# Altium schematic sheet Battery Monitoring.SchDoc
size A4; Author1: Russell MacGregor; VersionControl_Repository: BatteryMonitorSpring2025; Organization: Machine Intellgence Laboratory; Des1: This IC monitors the voltage; Des2: of the battery and the current; Des3: drawn from it.; SheetNumber: 2; SheetTotal: 4
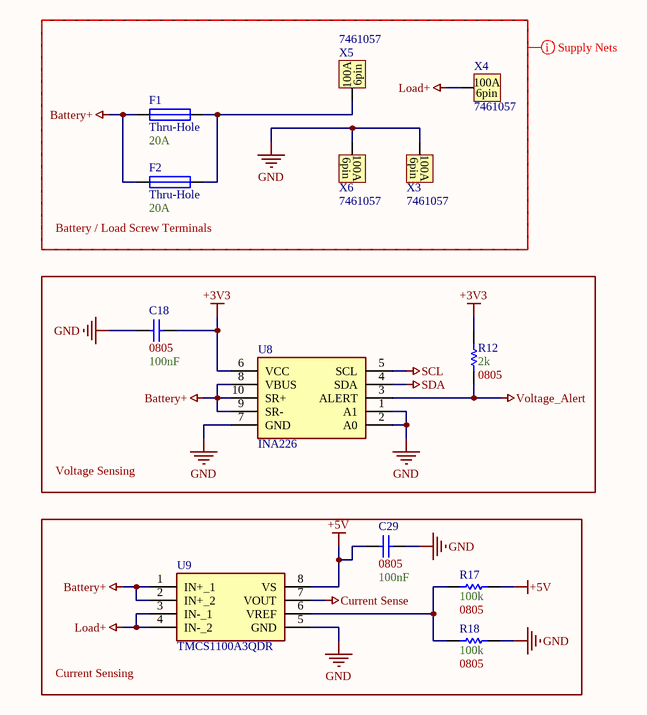
[diagram p0: Battery Monitoring.SchDoc]

## Parts
C18  Size Package: 0805  Capacitance: 100nF  [[Cap] SMD 0805]  (hidden comment: [Cap] SMD Nonpolarized)
C29  Size Package: 0805  Capacitance: 100nF  [[Cap] SMD 0805]  (hidden comment: [Cap] SMD Nonpolarized)
F1  Thru-Hole  Capacity: 20A  [[Fuse] Blade (2)]
F2  Thru-Hole  Capacity: 20A  [[Fuse] Blade (2)]
R12  Resistance: 2k  Size Package: 0805  [[Res] SMD 0805]  (hidden comment: [Res] SMD Resistor)
R17  Resistance: 100k  Size Package: 0805  [[Res] SMD 0805]  (hidden comment: [Res] SMD Resistor)
R18  Resistance: 100k  Size Package: 0805  [[Res] SMD 0805]  (hidden comment: [Res] SMD Resistor)
U8  INA226  [[IC] Battery Voltage Monitor (36V)]
U9  TMCS1100A3QDR  [[IC] Hall Effect Current Sensor]
X3  7461057  [[Port] Shank Connector (100A)]
X4  7461057  [[Port] Shank Connector (100A)]
X5  7461057  [[Port] Shank Connector (100A)]
X6  7461057  [[Port] Shank Connector (100A)]

## Blocks framed on the sheet
Battery / Load Screw Terminals: F1 F2 X3-X6
Voltage Sensing: C18 R12 U8
Current Sensing: C29 R17 R18 U9

## Nets
+3V3: C18.1 R12.2 U8.6(VCC)
+5V: C29.2 R17.2 U9.8(VS)
Battery+: F1.1 F2.1 U8.8(VBUS) U8.9(SR-) U8.10(SR+) U9.1(IN+_1) U9.2(IN+_2)
Current Sense: U9.7(VOUT)
GND: C18.2 C29.1 R18.1 U8.1(A1) U8.2(A0) U8.7(GND) U9.5(GND) X3.1 X6.1
Load+: U9.3(IN-_1) U9.4(IN-_2) X4.1
SCL: U8.5(SCL)
SDA: U8.4(SDA)
Voltage_Alert: R12.1 U8.3(ALERT)
NetF1_2: F1.2 F2.2 X5.1
NetR17_1: R17.1 R18.2 U9.6(VREF)

## Layout directives
net class Supply_Nets: Battery+, GND, Load+

## Notes on the sheet
- Project/Vehicle:
- Author(s):
- -
- Revisor(s):
- Git Repo:
- Git Hash:
- Date:
- Revision:
- Size:
- A4
- File:
- Sheet
- of
- (in symbol [Port] Shank Connector (100A)) 100A; 6pin

## Library data of the parts
F1 F2 = [Fuse] Thru-Hole Blade: Mouser Part #: *
U8 = [IC] Battery Voltage Monitor (36V): INA226AIDGST
U9 = [IC] Hall Effect Current Sensor: TMCS1100
X3-X6 = [Port] Shank Connector (100A): 7461057, internal thread
C18 C29 = [Cap] SMD Nonpolarized: JLC Part #: *; Mouser Part #: *